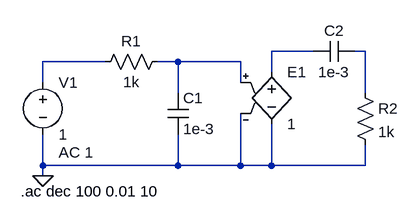
[diagram p0: schematic szim1.asc]
szim1.asc, the LTspice schematic file:
Version 4
SHEET 1 880 680
WIRE 480 80 416 80
WIRE 560 80 544 80
WIRE 160 96 64 96
WIRE 272 96 240 96
WIRE 368 96 272 96
WIRE 416 112 416 80
WIRE 64 128 64 96
WIRE 368 128 368 96
WIRE 272 144 272 96
WIRE 560 144 560 80
WIRE 64 256 64 208
WIRE 272 256 272 208
WIRE 272 256 64 256
WIRE 368 256 368 176
WIRE 368 256 272 256
WIRE 416 256 416 192
WIRE 416 256 368 256
WIRE 560 256 560 224
WIRE 560 256 416 256
WIRE 64 272 64 256
FLAG 64 272 0
SYMBOL voltage 64 112 R0
WINDOW 123 24 124 Left 2
WINDOW 39 0 0 Left 0
SYMATTR InstName V1
SYMATTR Value 1
SYMATTR Value2 AC 1
SYMBOL cap 256 144 R0
SYMATTR InstName C1
SYMATTR Value 1e-3
SYMBOL res 256 80 R90
WINDOW 0 0 56 VBottom 2
WINDOW 3 32 56 VTop 2
SYMATTR InstName R1
SYMATTR Value 1k
SYMBOL cap 544 64 R90
WINDOW 0 0 32 VBottom 2
WINDOW 3 32 32 VTop 2
SYMATTR InstName C2
SYMATTR Value 1e-3
SYMBOL res 544 128 R0
SYMATTR InstName R2
SYMATTR Value 1k
SYMBOL e 416 96 R0
SYMATTR InstName E1
SYMATTR Value 1
TEXT 30 296 Left 2 !.ac dec 100 0.01 10

The netlist it stands for:
* szim1.asc
V1 N003 0 1 AC 1
C1 N004 0 1e-3
R1 N004 N003 1k
C2 N002 N001 1e-3
R2 N002 0 1k
E1 N001 0 N004 0 1
.ac dec 100 0.01 10
.backanno
.end